# EAGLE design Sherlock (EAGLE 6.2)
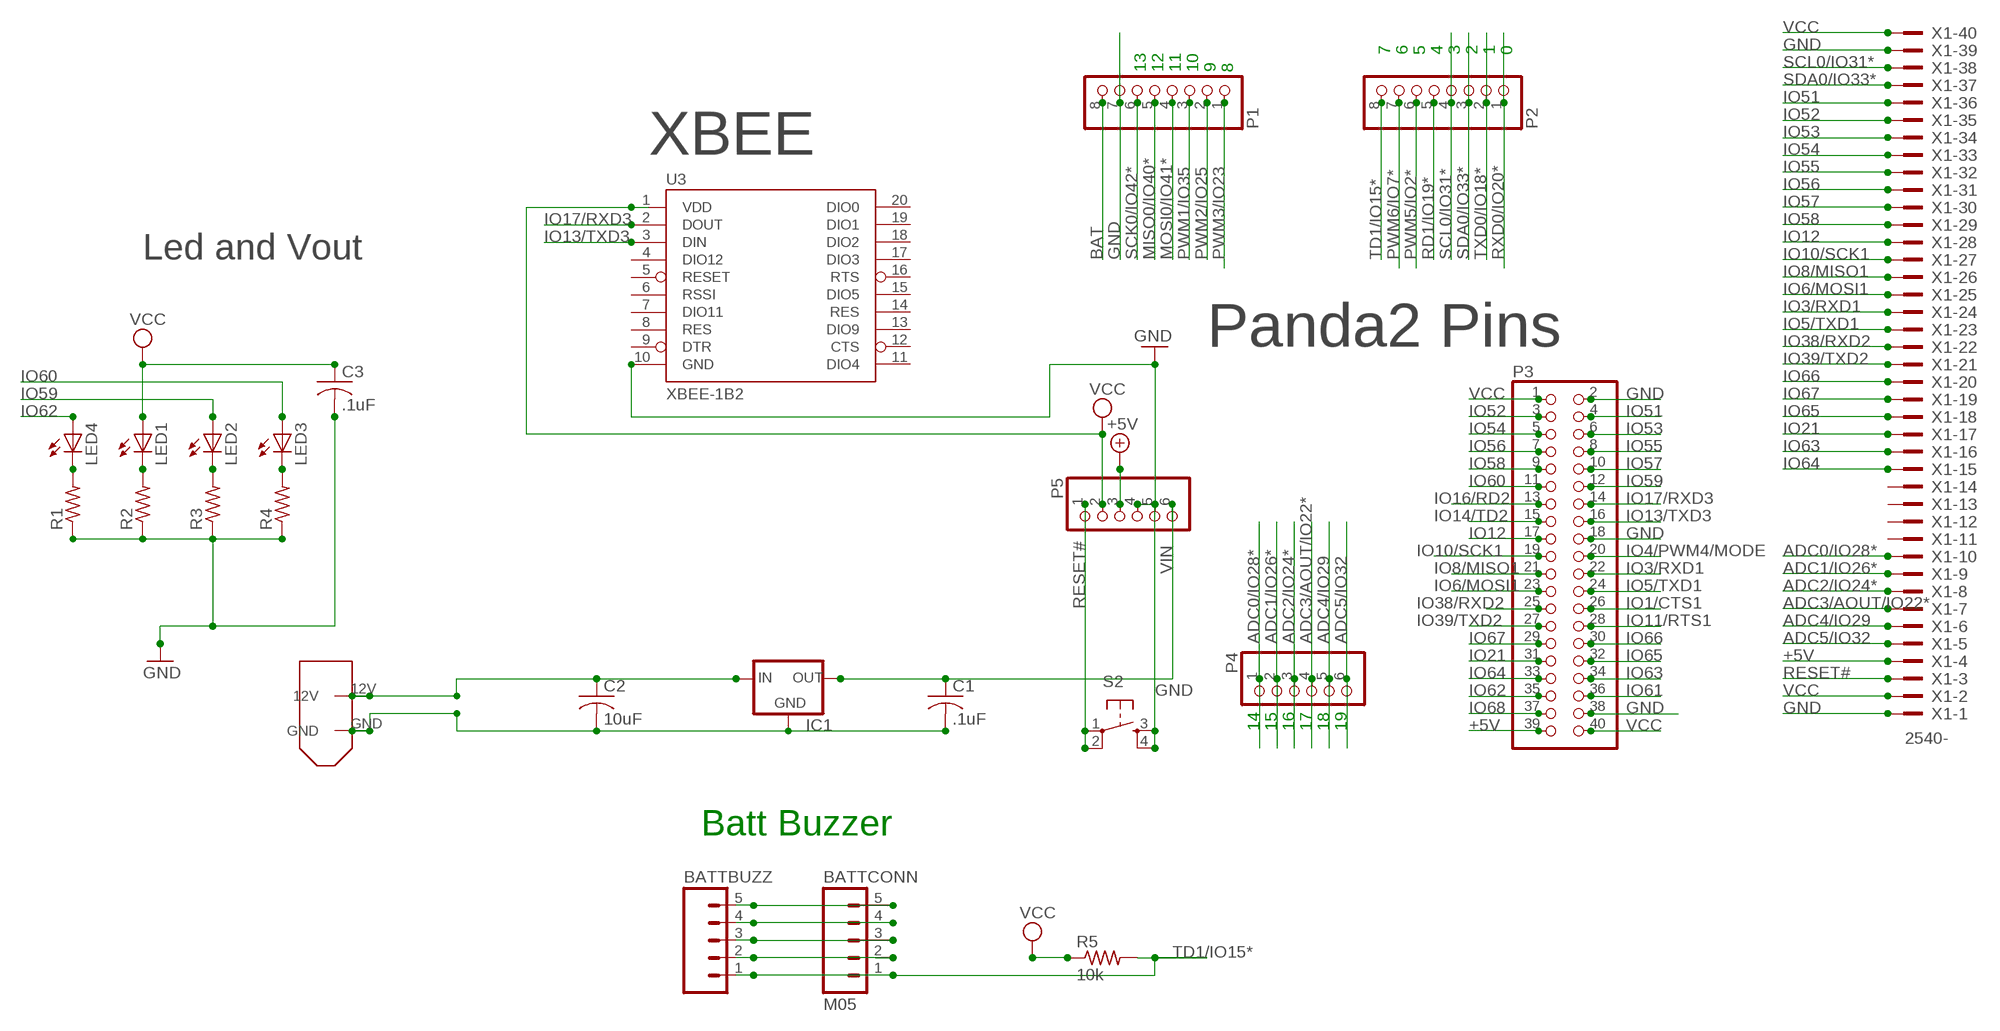
[diagram p0: schematic, sheet 1]

## Parts
BATTBUZZ  M05PTH  [1X05]
BATTCONN  M05  [1X05]
C1  .1uF  C-USC0603  [C0603]
C2  10uF  C-USC0603  [C0603]
C3  .1uF  C-USC0603K  [C0603K]
IC1  78XXL  [78XXL]
LED1  LED0603  [LED-0603]
LED2  LED0603  [LED-0603]
LED3  LED0603  [LED-0603]
LED4  LED0603  [LED-0603]
P1  PINHD-1X08_2.54-S  [1X08-S]
P2  PINHD-1X08_2.54-S  [1X08-S]
P3  PINHD-2X20  [2X20]
P4  PINHD-1X06_2.54-S  [1X06-S]
P5  PINHD-1X06_2.54-S  [1X06-S]
R1  R-US_R0603  [R0603]
R2  R-US_R0603  [R0603]
R3  R-US_R0603  [R0603]
R4  R-US_R0603  [R0603]
R5  10k  R-US_R0603  [R0603]
S2  TAC_SWITCHPTH  [TACTILE-PTH]
U3  XBEE-1B2  [XBEE-SILK]
U$1  XT60CONNECTOR  [XT60CONNECTOR]
X1  2540-  [PAK100/2500-40]

## Nets
12V: C2.1 IC1.IN U$1.12V
+5V [power]: P3.39 P5.3 X1.4
ADC0/IO28*: P4.1 X1.10
ADC1/IO26*: P4.2 X1.9
ADC2/IO24*: P4.3 X1.8
ADC3/AOUT/IO22*: P4.4 X1.7
ADC4/IO29: P4.5 X1.6
ADC5/IO32: P4.6 X1.5
BAT: P1.8
GND: C1.2 C2.2 C3.2 IC1.GND P1.7 P3.2 P3.18 P3.38 P5.4 P5.5 R1.1 R2.1 R3.1 R4.1 S2.3 S2.4 U3.10(GND) U$1.GND X1.1 X1.39
IO1/CTS1: P3.26
IO3/RXD1: P3.22 X1.24
IO4/PWM4/MODE: P3.20
IO5/TXD1: P3.24 X1.23
IO6/MOSI1: P3.23 X1.25
IO8/MISO1: P3.21 X1.26
IO10/SCK1: P3.19 X1.27
IO11/RTS1: P3.28
IO12: P3.17 X1.28
IO13/TXD3: P3.16 U3.3(DIN)
IO14/TD2: P3.15
IO16/RD2: P3.13
IO17/RXD3: P3.14 U3.2(DOUT)
IO21: P3.31 X1.17
IO38/RXD2: P3.25 X1.22
IO39/TXD2: P3.27 X1.21
IO51: P3.4 X1.36
IO52: P3.3 X1.35
IO53: P3.6 X1.34
IO54: P3.5 X1.33
IO55: P3.8 X1.32
IO56: P3.7 X1.31
IO57: P3.10 X1.30
IO58: P3.9 X1.29
IO59: LED2.A P3.12
IO60: LED3.A P3.11
IO61: P3.36
IO62: LED4.A P3.35
IO63: P3.34 X1.16
IO64: P3.33 X1.15
IO65: P3.32 X1.18
IO66: P3.30 X1.20
IO67: P3.29 X1.19
IO68: P3.37
MISO0/IO40*: P1.5
MOSI0/IO41*: P1.4
N$1: LED4.C R1.2
N$2: LED1.C R2.2
N$3: LED2.C R3.2
N$4: BATTBUZZ.5 BATTCONN.5
N$5: BATTBUZZ.4 BATTCONN.4
N$6: BATTBUZZ.3 BATTCONN.3
N$7: BATTBUZZ.2 BATTCONN.2
N$8: LED3.C R4.2
PWM1/IO35: P1.3
PWM2/IO25: P1.2
PWM3/IO23: P1.1
PWM5/IO2*: P2.6
PWM6/IO7*: P2.7
RD1/IO19*: P2.5
RESET#: P5.1 S2.1 S2.2 X1.3
RXD0/IO20*: P2.1
SCK0/IO42*: P1.6
SCL0/IO31*: P2.4 X1.38
SDA0/IO33*: P2.3 X1.37
TD1/IO15*: BATTBUZZ.1 BATTCONN.1 P2.8 R5.2
TXD0/IO18*: P2.2
VCC [power]: C3.1 LED1.A P3.1 P3.40 P5.2 R5.1 U3.1(VDD) X1.2 X1.40
VIN: C1.1 IC1.OUT P5.6
Unconnected: U3.4(DIO12) U3.5(RESET) U3.6(RSSI) U3.7(DIO11) U3.8(RES) U3.9(DTR) U3.11(DIO4) U3.12(CTS) U3.13(DIO9) U3.14(RES) U3.15(DIO5) U3.16(RTS) U3.17(DIO3) U3.18(DIO2) U3.19(DIO1) U3.20(DIO0) X1.11 X1.12 X1.13 X1.14

## Notes on the sheet
- 7 | 6 | 5 | 4 | 3 | 2 | 1 | 0
- 13 | 12 | 11 | 10 | 9 | 8
- XBEE
- Led and Vout
- Panda2 Pins
- 14 | 15 | 16 | 17 | 18 | 19
- Batt Buzzer

## Library data of the parts
BATTBUZZ = SparkFun:M05: Header 5 Standard 5-pin 0.1" header. Use with straight break away headers (SKU : PRT-00116), right angle break away headers (PRT-00553), swiss pins (PRT-00743), machine pins (PRT-00117), and female headers (PRT-00115). Molex polarized connector foot print use with SKU : PRT-08230 with associated crimp pins and housings.
BATTCONN = pie:M05
C1-C3 = rcl:C-US: CAPACITOR, American symbol
IC1 = pie:78XXL: VOLTAGE REGULATOR
LED1-LED4 = pie:LED: LEDs Standard schematic elements and footprints for 5mm, 3mm, 1206, and 0603 sized LEDs. 5mm - Spark Fun Electronics SKU : COM-00529 (and others)
P1 P2 = pinhead-2:PINHD-1X08: PIN HEADER
P3 = pinhead:PINHD-2X20: PIN HEADER
P4 P5 = pinhead-2:PINHD-1X06: PIN HEADER
R1-R4 = rcl:R-US_: RESISTOR, American symbol
R5 = resistor:R-US_: RESISTOR, American symbol
S2 = SparkFun:TAC_SWITCH: Momentary Switch Button commonly used for reset or general input. Spark Fun Electronics SKU : COM-00097
U3 = SparkFun:XBEE-1
U$1 = pie:XT60CONNECTOR: 12V XT60 power connector
X1 = con-3m:2540-: 3M (TM) Pak 100 4-Wall Header Source: 3M; OC_FARNELL: unknown; OC_NEWARK: unknown

## Net classes
1 power: width 0.406 mm, drill 0.381 mm, clearance 0.203 mm

## Board
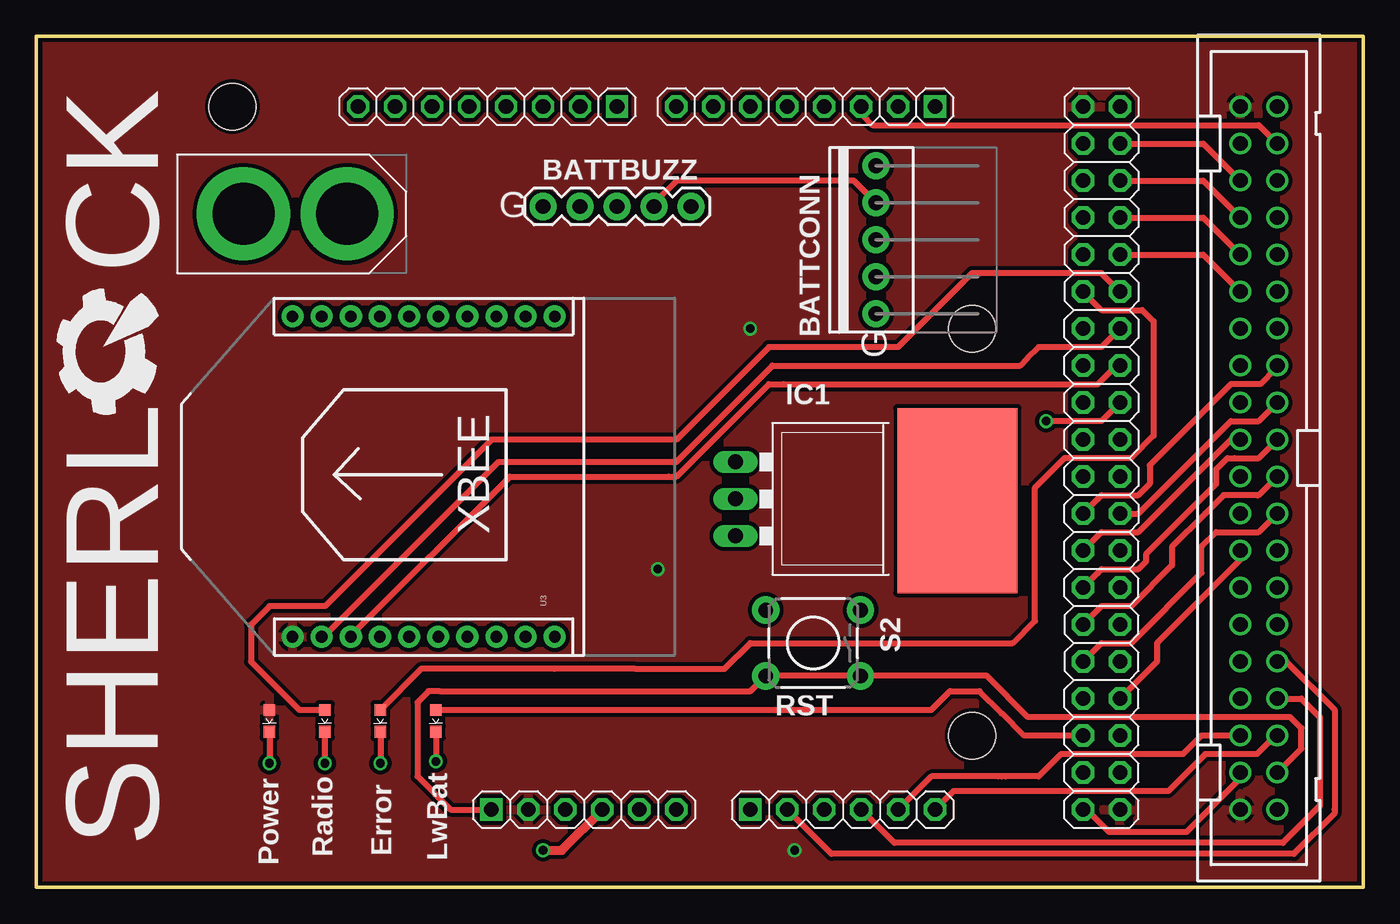
[diagram p1: board, top side]
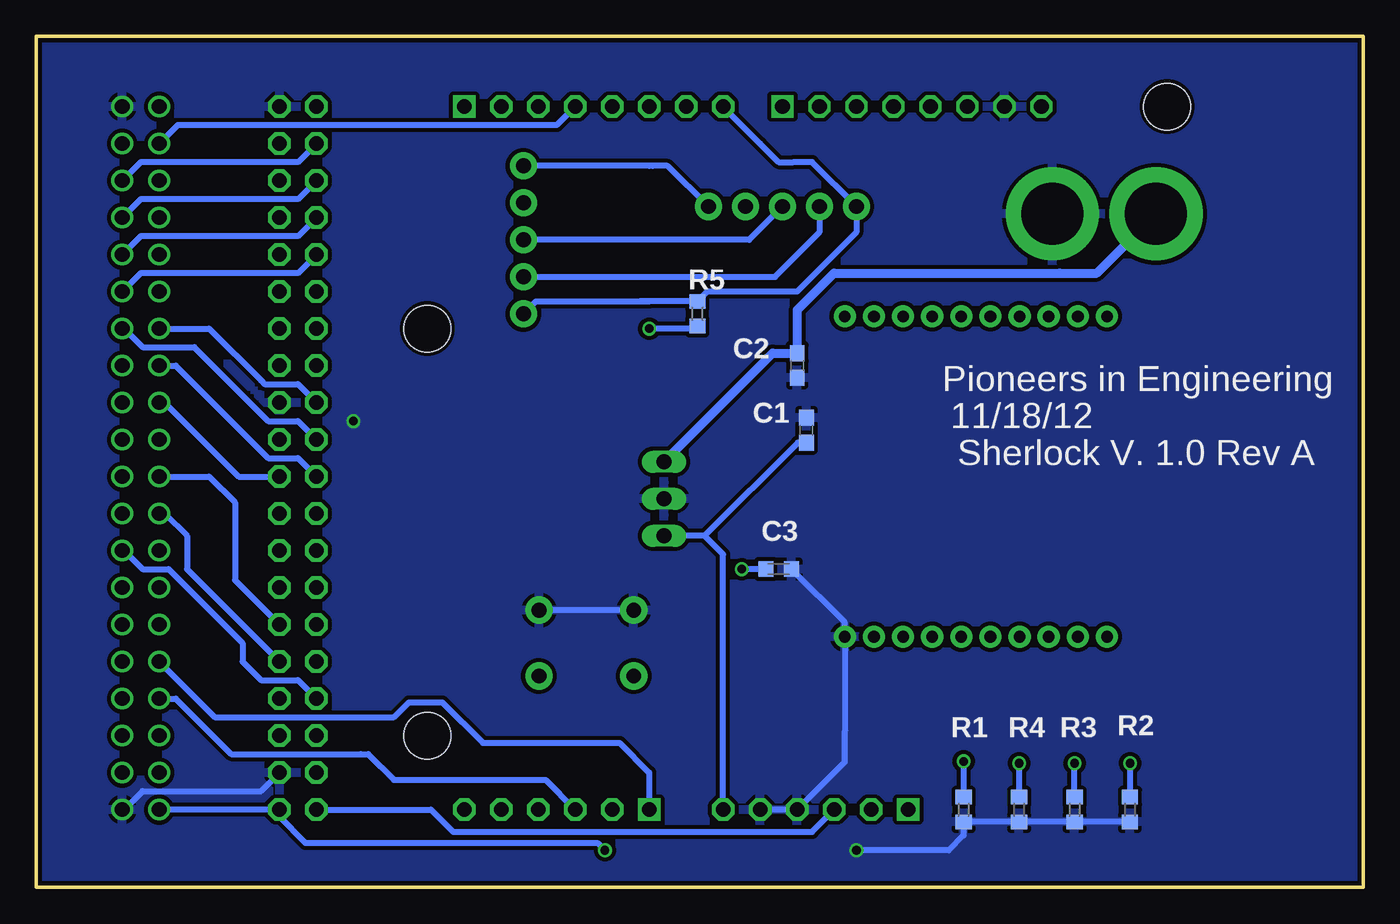
[diagram p2: board, bottom side, seen from below]

Size 91.11 x 58.41 mm. Coordinates in mm from the lower left corner, seen from the top.
Outline: 0,0 91.11,0 91.11,58.41 0,58.41 0,0
Copper layers (1*16): Top 2mil / dielectric 9mil / Bottom 2mil
Design rules "advancedcircuits-33each-pie": minimum track width 6mil, minimum drill 15mil, track to track 6mil, track to pad 10mil, pad to pad 6mil, via to via 6mil, smd to smd 6mil, copper to edge 10mil, drill to drill 7mil, minimum pad ring 7mil, minimum via ring 7mil, stop-mask expansion 3mil, vias tented up to drill 0mil, thermal gap 10mil
Holes 3.2 mm at 64.26,10.41 13.46,53.59 64.26,38.35

### Footprints (pad centres in the part's own frame; a part is rotated, then mirrored left to right if it is on the bottom)
1X05 = drill 1.016 pad 1.88: 1 0,0; 2 2.54,0; 3 5.08,0; 4 7.62,0; 5 10.16,0
1X05' = drill 1.016 pad 1.88: 1 -5.08,0; 2 -2.54,0; 3 0,0; 4 2.54,0; 5 5.08,0
C0603 = smd 1.1 x 1: 1 -0.85,0; 2 0.85,0
C0603K = smd 1.05 x 1.08: 1 -0.875,0; 2 0.875,0
78XXL = drill 1.016 long: GND 0,-3.81; IN -2.54,-3.81; OUT 2.54,-3.81 | smd 12.7 x 8.255: PAD 0.127,11.43
LED-0603 = smd 0.8 x 0.8: A 0,-0.75; C 0,0.75
1X08-S = drill 1.016 square: 1 -8.89,0 | drill 1.016 octagon: 2 -6.35,0; 3 -3.81,0; 4 -1.27,0; 5 1.27,0; 6 3.81,0; 7 6.35,0; 8 8.89,0
2X20 = drill 1.016 octagon: 1 -24.13,-1.27; 2 -24.13,1.27; 3 -21.59,-1.27; 4 -21.59,1.27; 5 -19.05,-1.27; 6 -19.05,1.27; 7 -16.51,-1.27; 8 -16.51,1.27; 9 -13.97,-1.27; 10 -13.97,1.27; 11 -11.43,-1.27; 12 -11.43,1.27; 13 -8.89,-1.27; 14 -8.89,1.27; 15 -6.35,-1.27; 16 -6.35,1.27; 17 -3.81,-1.27; 18 -3.81,1.27; 19 -1.27,-1.27; 20 -1.27,1.27; 21 1.27,-1.27; 22 1.27,1.27; 23 3.81,-1.27; 24 3.81,1.27; 25 6.35,-1.27; 26 6.35,1.27; 27 8.89,-1.27; 28 8.89,1.27; 29 11.43,-1.27; 30 11.43,1.27; 31 13.97,-1.27; 32 13.97,1.27; 33 16.51,-1.27; 34 16.51,1.27; 35 19.05,-1.27; 36 19.05,1.27; 37 21.59,-1.27; 38 21.59,1.27; 39 24.13,-1.27; 40 24.13,1.27
1X06-S = drill 1.016 square: 1 -6.35,0 | drill 1.016 octagon: 2 -3.81,0; 3 -1.27,0; 4 1.27,0; 5 3.81,0; 6 6.35,0
R0603 = smd 1 x 1.1: 1 -0.85,0; 2 0.85,0
TACTILE-PTH = drill 1.016 pad 1.88: 1 -3.251,2.261; 2 3.251,2.261; 3 -3.251,-2.261; 4 3.251,-2.261
XBEE-SILK = drill 0.8 pad 1.524: 1 -11,20; 2 -11,18; 3 -11,16; 4 -11,14; 5 -11,12; 6 -11,10; 7 -11,8; 8 -11,6; 9 -11,4; 10 -11,2; 11 11,2; 12 11,4; 13 11,6; 14 11,8; 15 11,10; 16 11,12; 17 11,14; 18 11,16; 19 11,18; 20 11,20
XT60CONNECTOR = drill 4.267: 12V 4.572,4.064; GND 11.684,4.064
PAK100/2500-40 = drill 1 pad 1.422: 1 -24.13,-1.27; 2 -24.13,1.27; 3 -21.59,-1.27; 4 -21.59,1.27; 5 -19.05,-1.27; 6 -19.05,1.27; 7 -16.51,-1.27; 8 -16.51,1.27; 9 -13.97,-1.27; 10 -13.97,1.27; 11 -11.43,-1.27; 12 -11.43,1.27; 13 -8.89,-1.27; 14 -8.89,1.27; 15 -6.35,-1.27; 16 -6.35,1.27; 17 -3.81,-1.27; 18 -3.81,1.27; 19 -1.27,-1.27; 20 -1.27,1.27; 21 1.27,-1.27; 22 1.27,1.27; 23 3.81,-1.27; 24 3.81,1.27; 25 6.35,-1.27; 26 6.35,1.27; 27 8.89,-1.27; 28 8.89,1.27; 29 11.43,-1.27; 30 11.43,1.27; 31 13.97,-1.27; 32 13.97,1.27; 33 16.51,-1.27; 34 16.51,1.27; 35 19.05,-1.27; 36 19.05,1.27; 37 21.59,-1.27; 38 21.59,1.27; 39 24.13,-1.27; 40 24.13,1.27

### Placement (x,y rotation side)
BATTBUZZ  34.8,46.74 0 top
BATTCONN  M05  [1X05']  57.66,44.45 90 top
C1  38.23,31.37 90 bottom
C2  38.86,35.81 270 bottom
C3  40.13,21.84 0 bottom
IC1  51.82,26.67 270 top
LED1  16,11.43 180 top
LED2  19.81,11.43 180 top
LED3  23.62,11.43 180 top
LED4  27.43,11.43 180 top
P1  30.99,53.59 180 top
P2  52.83,53.59 180 top
P3  73.15,29.46 270 top
P4  55.37,5.33 0 top
P5  37.59,5.33 0 top
R1  330  [R0603]  27.43,5.33 90 bottom
R2  330  [R0603]  16,5.33 90 bottom
R3  330  [R0603]  19.81,5.33 90 bottom
R4  330  [R0603]  23.62,5.33 90 bottom
R5  45.72,39.37 90 bottom
S2  53.34,16.76 180 top
U3  37.59,28.19 90 top
U$1  9.65,42.16 0 top
U$2  [SHERLOCK]  4.57,32 90 top
X1  83.95,29.46 90 top

### Tracks (layer width: path | path; a pad name or v marks a point on that pad's centre or on a via)
12V
  Bottom 0.406: IC1.IN 47.75,29.46
  Bottom 0.61: U$1.12V 18.29,42.16 20.83,42.16 36.32,42.16 38.16,40.32 38.86,39.62 C2.1 40.55,36.66 47.75,29.46
+5V
  Top 0.406: P3.39 72.14,5.33 73.66,3.81 78.99,3.81 82.68,7.49 X1.4
  Bottom 0.406: P3.39 64.01,5.33 62.48,3.81 47.24,3.81 37.85,3.81 P5.3
ADC0/IO28*
  Bottom 0.406: X1.10 78.87,11.68 66.55,11.68 65.53,12.7 63.25,12.7 60.45,9.91 51.05,9.91 49.02,7.87 P4.1
ADC1/IO26*
  Top 0.406: X1.9 85.85,15.49 89.15,12.19 89.15,5.33 89.15,5.08 86.36,2.29 54.61,2.29 P4.2
ADC2/IO24*
  Bottom 0.406: X1.8 81.53,12.95 77.72,9.14 68.83,9.14 68.33,9.14 66.55,7.37 56.13,7.37 P4.3
ADC3/AOUT/IO22*
  Top 0.406: X1.7 86.87,12.95 88.14,11.68 88.14,5.59 85.6,3.05 58.93,3.05 P4.4
ADC4/IO29
  Top 0.406: P4.5 59.18,5.08 P4.5 | 59.18,5.59 P4.5 | X1.6 80.01,10.41 78.74,9.14 70.36,9.14 68.83,7.62 66.04,7.62 | 66.55,7.62 66.29,7.62 66.04,7.62 | 66.04,7.62 61.47,7.62 P4.5
ADC5/IO32
  Top 0.406: X1.5 85.09,10.41 83.82,9.14 80.26,9.14 77.72,6.6 62.99,6.6 P4.6
GND  (via drill 0.6)
  Top 0.406: P3.18 73.15,32 v69.34,32
  Top 0.61: v34.8,2.54 36.07,2.54 P5.4
  Bottom 0.406: C3.2 35.59,18.18 U3.10 35.59,10.7 35.59,8.6 P5.4 P5.5 | R2.1 R3.1 R4.1 R1.1 27.43,3.56 28.45,2.54 v34.8,2.54 | S2.4 S2.3 | X1.1 85.09,5.33 83.82,6.6 75.69,6.6 P3.38
  pour Bottom (isolate 0.279): 0,0.38 91.19,0 91.57,58.42 0,58.67
IO3/RXD1
  Bottom 0.406: X1.24 82.3,33.27 77.22,28.19 P3.22
IO5/TXD1
  Top 0.406: P3.24 75.69,25.65 82.04,32 83.95,32 X1.23
IO6/MOSI1
  Top 0.406: X1.25 85.22,35.69 85.09,35.56 84.07,34.54 82.04,34.54 76.45,28.96 76.45,27.69 75.69,26.92 73.15,26.92 72.9,26.67 P3.23
IO8/MISO1
  Bottom 0.406: X1.26 81.53,35.81 75.18,29.46 73.15,29.46 P3.21
IO10/SCK1
  Bottom 0.406: X1.27 85.09,38.35 83.82,37.08 80.26,37.08 75.18,32 73.15,32 P3.19
IO12
  Bottom 0.406: X1.28 79.25,38.35 75.69,34.8 75.44,34.54 73.15,34.54 P3.17
IO13/TXD3
  Top 0.406: U3.3 21.59,17.27 32.51,28.19 43.43,28.19 43.94,28.19 50.29,34.54 51.31,34.54 72.9,34.54 74.17,35.81 P3.16
IO17/RXD3
  Top 0.406: P3.14 73.15,37.08 68.83,37.08 68.07,36.32 | 67.56,35.81 68.07,36.32 | U3.2 19.73,17.19 31.75,29.21 43.94,29.21 50.55,35.81 67.56,35.81 | 67.56,35.81 68.07,36.32
IO21
  Top 0.406: P3.31 73.15,16.76 75.18,16.76 80.01,21.59 80.01,23.37 81.03,24.38 83.95,24.38 X1.17
IO38/RXD2
  Top 0.406: X1.22 82.8,30.73 X1.22 | X1.22 82.3,30.73 | P3.25 73.15,24.38 75.69,24.38 82.04,30.73 X1.22
IO39/TXD2
  Top 0.406: P3.27 72.9,21.59 73.15,21.84 75.69,21.84 76.2,22.35 76.2,22.86 81.03,27.69 81.03,28.7 81.79,29.46 82.3,29.46 83.95,29.46 X1.21
IO51
  Top 0.406: P3.4 80.14,51.05 X1.36
IO52
  Bottom 0.406: P3.3 73.15,49.78 83.95,49.78 X1.35
IO53
  Top 0.406: P3.6 80.14,48.51 X1.34
IO54
  Bottom 0.406: P3.5 73.15,47.24 83.95,47.24 X1.33
IO55
  Top 0.406: P3.8 80.14,45.97 X1.32
IO56
  Bottom 0.406: P3.7 73.15,44.7 83.95,44.7 X1.31
IO57
  Top 0.406: P3.10 80.14,43.43 X1.30
IO58
  Bottom 0.406: P3.9 73.15,42.16 83.95,42.16 X1.29
IO59
  Top 0.406: P3.12 73.15,42.16 69.34,42.16 64.26,42.16 59.18,37.08 57.91,37.08 50.29,37.08 43.94,30.73 31.24,30.73 19.81,19.3 16,19.3 14.73,18.03 14.73,15.49 18.05,12.18 LED2.A
IO60
  Top 0.406: P3.11 73.15,39.62 75.95,39.62 76.71,38.86 76.71,30.99 75.18,29.46 70.61,29.46 68.58,27.43 68.58,18.29 67.06,16.76 49.02,16.76 47.24,14.99 41.15,14.99 35.56,14.99 26.42,14.99 LED3.A
IO62
  Top 0.406: LED4.A 61.46,12.18 62.74,13.46 64.77,13.46 66.29,11.94 67.82,10.41 P3.35
IO63
  Top 0.406: X1.16 82.68,22.48 76.96,16.76 76.96,15.49 P3.34
IO64
  Bottom 0.406: X1.15 85.22,22.73 84.71,22.73 83.82,21.84 82.04,21.84 78.99,18.8 76.96,16.76 76.96,15.49 75.69,14.22 73.15,14.22 P3.33
IO65
  Bottom 0.406: X1.18 82.3,25.65 80.77,24.13 80.77,21.84 P3.32
IO66
  Bottom 0.406: X1.20 79.25,28.19 77.47,26.42 77.47,21.08 P3.30
IO67
  Top 0.406: P3.29 73.15,19.3 75.18,19.3 77.98,22.1 77.98,23.37 80.26,25.65 81.53,26.92 83.82,26.92 83.95,26.92 X1.19
N$1  (via drill 0.6)
  Top 0.406: LED4.C v27.43,8.64
  Bottom 0.406: v27.43,8.64 R1.2
N$2  (via drill 0.6)
  Top 0.406: LED1.C v16,8.51
  Bottom 0.406: v16,8.51 R2.2
N$3  (via drill 0.6)
  Top 0.406: v19.81,8.51 LED2.C
  Bottom 0.406: R3.2 v19.81,8.51
N$4
  Bottom 0.406: 48.77,49.53 49.02,49.53 | 49.02,49.53 BATTCONN.5 | BATTBUZZ.5 47.75,49.53 49.02,49.53
N$5
  Top 0.406: BATTCONN.4 56.13,48.51 43.94,48.51 42.42,46.99 BATTBUZZ.4
N$6
  Bottom 0.406: BATTBUZZ.3 42.16,44.45 BATTCONN.3
N$7
  Bottom 0.406: BATTBUZZ.2 37.34,44.96 40.13,42.16 40.39,41.91 BATTCONN.2
N$8  (via drill 0.6)
  Top 0.406: LED3.C v23.62,8.51
  Bottom 0.406: v23.62,8.51 R4.2
RESET#
  Top 0.406: P5.1 28.45,5.33 26.16,7.62 26.16,12.7 26.92,13.46 27.69,13.46 49.05,13.46 S2.2 S2.1 65.28,14.5 68.1,11.68 68.33,11.68 86.11,11.68 86.87,10.92 86.87,9.53 X1.3
SCL0/IO31*
  Bottom 0.406: P2.4 55.37,52.32 81.41,52.32 X1.38
SDA0/IO33*
  Top 0.406: P2.3 56.64,53.09 57.4,52.32 83.95,52.32 X1.37
TD1/IO15*
  Bottom 0.406: P2.8 41.4,51.05 40.13,49.78 39.12,49.78 38.86,49.78 37.85,49.78 BATTBUZZ.1 34.8,44.96 38.86,40.89 40.13,40.89 45.05,40.89 R5.2 49.02,40.22 | 49.02,40.22 49.7,40.22 | BATTCONN.1 56.81,40.22 49.02,40.22
VCC  (via drill 0.6)
  Top 0.406: v52.07,2.54 52.07,2.79
  Bottom 0.406: X1.2 P3.40 74.42,4.83 72.64,3.05 52.58,3.05 v52.07,2.54 | R5.1 45.89,38.35 v49.02,38.35 | C3.1 41.4,21.84 v42.67,21.84
  pour Top (isolate 0.279): 0,0.25 91.19,-0.13 91.31,58.17 0,58.42
VIN
  Bottom 0.406: P5.6 43.94,22.86 45.21,24.13 | C1.1 38.82,30.52 45.21,24.13 | 45.21,24.13 IC1.OUT

### Text on the board
tPlace: G | G | XBEE | RST | Radio | LwBat | Power | Error
bPlace: Pioneers in Engineering | 11/18/12 | Sherlock V. 1.0 Rev A